# Altium schematic sheet CW308T_ADUCM3029_UFO.SchDoc: <Enter Sheet Title>
size Letter; Organization: NewAE Technology Inc.; Address1: 1083 Queen St., Suite 196; Address2: Halifax; Address3: NS; Address4: Canada B3H 0B2; SheetApproved: NO
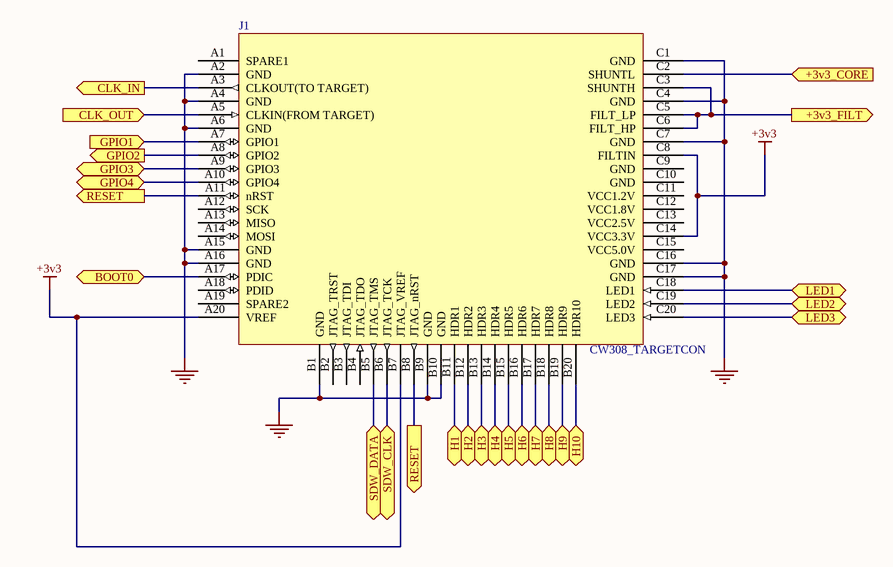
[diagram p0: CW308T_ADUCM3029_UFO.SchDoc]

## Parts
J1  CW308_TARGETCON  [CW308_TBOARD_CONN]

## Ports
+3v3_CORE (in), +3v3_FILT (out), BOOT0 (bidir), CLK_IN (out), CLK_OUT (in), GPIO1 (in), GPIO2 (out), GPIO3 (bidir), GPIO4 (bidir), H1 (bidir), H2 (bidir), H3 (bidir), H4 (bidir), H5 (bidir), H6 (bidir), H7 (bidir), H8 (bidir), H9 (bidir), H10 (bidir), LED1 (bidir), LED2 (bidir), LED3 (bidir), RESET (out), SDW_CLK (bidir), SDW_DATA (bidir)

## Nets
+3v3: J1.A20(VREF) J1.B7(JTAG_VREF) J1.C8(FILTIN) J1.C14(VCC3.3V)
GND: J1.A2(GND) J1.A4(GND) J1.A6(GND) J1.A15(GND) J1.A16(GND) J1.B1(GND) J1.B9(GND) J1.B10(GND) J1.C1(GND) J1.C4(GND) J1.C7(GND) J1.C16(GND) J1.C17(GND)
+3v3_CORE: J1.C2(SHUNTL) ; port +3v3_CORE
+3v3_FILT: J1.C3(SHUNTH) J1.C5(FILT_LP) J1.C6(FILT_HP) ; port +3v3_FILT
BOOT0: J1.A17(PDIC) ; port BOOT0
CLK_IN: J1.A3(CLKOUT(TO_TARGET)) ; port CLK_IN
CLK_OUT: J1.A5(CLKIN(FROM_TARGET)) ; port CLK_OUT
GPIO1: J1.A7(GPIO1) ; port GPIO1
GPIO2: J1.A8(GPIO2) ; port GPIO2
GPIO3: J1.A9(GPIO3) ; port GPIO3
GPIO4: J1.A10(GPIO4) ; port GPIO4
H1: J1.B11(HDR1) ; port H1
H2: J1.B12(HDR2) ; port H2
H3: J1.B13(HDR3) ; port H3
H4: J1.B14(HDR4) ; port H4
H5: J1.B15(HDR5) ; port H5
H6: J1.B16(HDR6) ; port H6
H7: J1.B17(HDR7) ; port H7
H8: J1.B18(HDR8) ; port H8
H9: J1.B19(HDR9) ; port H9
H10: J1.B20(HDR10) ; port H10
LED1: J1.C18(LED1) ; port LED1
LED2: J1.C19(LED2) ; port LED2
LED3: J1.C20(LED3) ; port LED3
RESET: J1.A11(nRST) J1.B8(JTAG_nRST) ; port RESET
SDW_CLK: J1.B6(JTAG_TCK) ; port SDW_CLK
SDW_DATA: J1.B5(JTAG_TMS) ; port SDW_DATA

Not connected (* = marked no-connect by the designer): J1 A1(SPARE1) A12(SCK) A13(MISO) A14(MOSI) A18(PDID) A19(SPARE2) B2(JTAG_TRST) B3(JTAG_TDI) B4(JTAG_TDO) C9(GND) C10(GND) C11(VCC1.2V) C12(VCC1.8V) C13(VCC2.5V) C15(VCC5.0V)

## Notes on the sheet
- Title:
- Date:
- Rev:
- Time:
- Project:
- Sheet
- of
- License:
- Copyright © NewAE Technology Inc.
- Approved:
- NewAE.com
- File:

## Library data of the parts
J1 = CW308_TBOARD: CW308 "Standard" Target Board Connector; Component Group: Mechanical; Pitch: 2.54mm; Part Number: CW308_TBOARD; Pin Count: 60; Mounting Technology: Through-hole; Component Kind: Standard; Component Type: Standard